# EAGLE schematic series parallel examples3 (EAGLE 7.5.0)
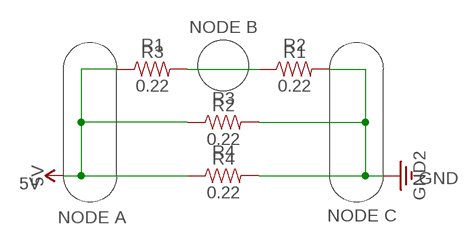
[diagram p0: schematic, sheet 1]

## Parts
R1  0.22  0.22OHM-0805-1/4W-1%  [0805]
R2  0.22  0.22OHM-0805-1/4W-1%  [0805]
R3  0.22  0.22OHM-0805-1/4W-1%  [0805]
R4  0.22  0.22OHM-0805-1/4W-1%  [0805]

## Nets
3.3V: R1.2 R2.2 R4.2 ; supply symbol labelled GND2
5V: R2.1 R3.1 R4.1
N$1: R1.1 R3.2

## Notes on the sheet
- NODE B
- R1 | R2
- R3
- R4
- 5V
- GND
- NODE A | NODE C

## Library data of the parts
R1-R4 = SparkFun-Resistors:0.22OHM: 0.22Ω resistor A resistor is a passive two-terminal electrical component that implements electrical resistance as a circuit element. Resistors act to reduce current flow, and, at the same time, act to lower voltage levels within circuits. - Wikipedia; PROD_ID: RES-09883